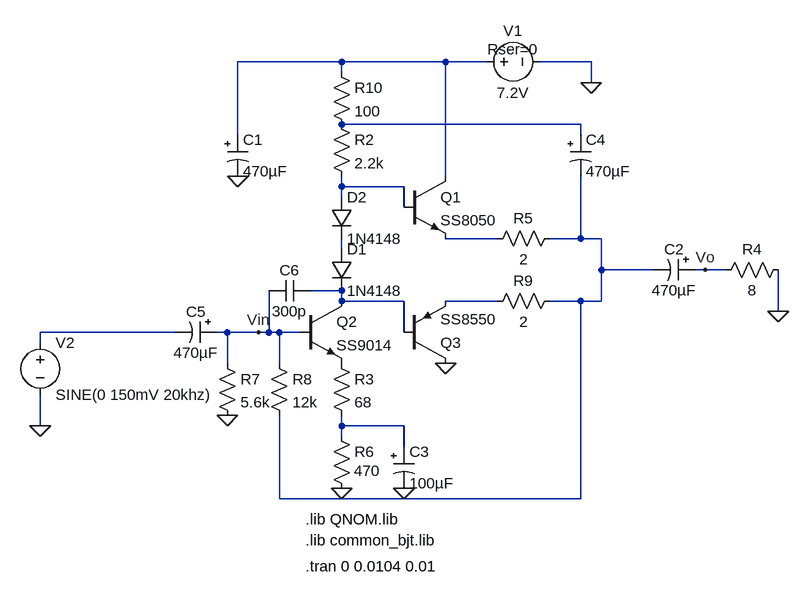
[diagram p0: schematic universal-audio-amplifer.asc]
universal-audio-amplifer.asc, the LTspice schematic file:
Version 4
SHEET 1 880 680
WIRE 64 -320 -96 -320
WIRE 224 -320 64 -320
WIRE 288 -320 224 -320
WIRE 448 -320 368 -320
WIRE 64 -304 64 -320
WIRE 448 -288 448 -320
WIRE 432 -224 64 -224
WIRE -96 -208 -96 -320
WIRE 432 -208 432 -224
WIRE 224 -144 224 -320
WIRE 64 -128 64 -144
WIRE 160 -128 64 -128
WIRE 64 -112 64 -128
WIRE 160 -96 160 -128
WIRE 304 -48 224 -48
WIRE 432 -48 432 -144
WIRE 432 -48 384 -48
WIRE 464 -48 432 -48
WIRE 64 -32 64 -48
WIRE 464 0 464 -48
WIRE 544 0 464 0
WIRE 624 0 608 0
WIRE 656 0 624 0
WIRE 64 32 16 32
WIRE 64 48 64 32
WIRE 160 48 64 48
WIRE 304 48 224 48
WIRE 432 48 384 48
WIRE 464 48 464 0
WIRE 464 48 432 48
WIRE 736 64 736 0
WIRE -192 96 -400 96
WIRE -112 96 -128 96
WIRE -64 96 -112 96
WIRE -48 96 -48 32
WIRE -48 96 -64 96
WIRE -32 96 -48 96
WIRE 0 96 -32 96
WIRE 160 96 160 48
WIRE -400 112 -400 96
WIRE -112 144 -112 96
WIRE -32 144 -32 96
WIRE -400 240 -400 192
WIRE 64 240 64 224
WIRE 160 240 64 240
WIRE 64 256 64 240
WIRE 160 272 160 240
WIRE -32 352 -32 224
WIRE 432 352 432 48
WIRE 432 352 -32 352
FLAG -400 240 0
FLAG 736 64 0
FLAG 160 336 0
FLAG 224 144 0
FLAG 64 336 0
FLAG -96 -144 0
FLAG 448 -288 0
FLAG -112 224 0
FLAG -64 96 Vin
FLAG 624 0 Vo
SYMBOL npn 160 -144 R0
SYMATTR InstName Q1
SYMATTR Value SS8050
SYMBOL voltage 272 -320 R270
WINDOW 0 32 56 VTop 2
WINDOW 3 -32 56 VBottom 2
WINDOW 123 0 0 Left 2
WINDOW 39 4 56 VTop 2
SYMATTR InstName V1
SYMATTR Value 7.2V
SYMATTR SpiceLine Rser=0
SYMBOL voltage -400 96 R0
WINDOW 123 0 0 Left 2
WINDOW 39 0 0 Left 2
SYMATTR InstName V2
SYMATTR Value SINE(0 150mV 20khz)
SYMBOL res 640 16 R270
WINDOW 0 32 56 VTop 2
WINDOW 3 0 56 VBottom 2
SYMATTR InstName R4
SYMATTR Value 8
SYMATTR SpiceLine tol=1% pwr=1
SYMBOL res 48 -240 R0
SYMATTR InstName R2
SYMATTR Value 2.2k
SYMATTR SpiceLine tol=1% pwr=1
SYMBOL npn 0 48 R0
SYMATTR InstName Q2
SYMATTR Value SS9014
SYMBOL pnp 160 144 M180
SYMATTR InstName Q3
SYMATTR Value SS8550
SYMBOL diode 48 -32 R0
SYMATTR InstName D1
SYMATTR Value 1N4148
SYMBOL diode 48 -112 R0
SYMATTR InstName D2
SYMATTR Value 1N4148
SYMBOL res 48 128 R0
SYMATTR InstName R3
SYMATTR Value 68
SYMATTR SpiceLine tol=1% pwr=1
SYMBOL res 48 240 R0
WINDOW 3 35 69 Left 2
SYMATTR InstName R6
SYMATTR Value 470
SYMATTR SpiceLine tol=1% pwr=1
SYMBOL res -128 128 R0
SYMATTR InstName R7
SYMATTR Value 5.6k
SYMATTR SpiceLine tol=1% pwr=1
SYMBOL res -48 128 R0
SYMATTR InstName R8
SYMATTR Value 12k
SYMATTR SpiceLine tol=1% pwr=1
SYMBOL polcap 144 272 R0
SYMATTR InstName C3
SYMATTR Value 100µF
SYMATTR SpiceLine V=50 Irms=22m Rser=3.9 Lser=0
SYMBOL polcap 416 -208 R0
SYMATTR InstName C4
SYMATTR Value 470µF
SYMATTR SpiceLine V=35 Irms=1.2 Rser=0.08 Lser=0
SYMBOL polcap -128 80 R90
WINDOW 0 0 32 VBottom 2
WINDOW 3 32 32 VTop 2
SYMATTR InstName C5
SYMATTR Value 470µF
SYMATTR SpiceLine V=100 Irms=10m Rser=0.01 Lser=0
SYMBOL polcap -112 -208 R0
SYMATTR InstName C1
SYMATTR Value 470µF
SYMATTR SpiceLine V=35 Irms=750m Rser=0.0016 Lser=0
SYMBOL res 288 -32 R270
WINDOW 0 32 56 VTop 2
WINDOW 3 0 56 VBottom 2
SYMATTR InstName R5
SYMATTR Value 2
SYMATTR SpiceLine tol=1% pwr=1
SYMBOL res 288 64 R270
WINDOW 0 32 56 VTop 2
WINDOW 3 0 56 VBottom 2
SYMATTR InstName R9
SYMATTR Value 2
SYMATTR SpiceLine tol=1% pwr=1
SYMBOL res 48 -320 R0
SYMATTR InstName R10
SYMATTR Value 100
SYMATTR SpiceLine tol=1% pwr=1
SYMBOL polcap 608 -16 R90
WINDOW 0 0 32 VBottom 2
WINDOW 3 32 32 VTop 2
SYMATTR InstName C2
SYMATTR Value 470µF
SYMATTR SpiceLine V=100 Irms=10m Rser=0.01 Lser=0
SYMBOL cap 16 16 R90
WINDOW 0 0 32 VBottom 2
WINDOW 3 32 32 VTop 2
SYMATTR InstName C6
SYMATTR Value 300p
SYMATTR SpiceLine V=10 Irms=0 Rser=0.009 Lser=0
TEXT 8 416 Left 2 !.lib common_bjt.lib
TEXT 8 456 Left 2 !.tran 0 0.0104 0.01
TEXT 8 384 Left 2 !.lib QNOM.lib

The netlist it stands for:
* universal-audio-amplifer.asc
Q1 N001 N003 N004 0 SS8050
V1 N001 0 7.2V Rser=0
V2 N009 0 SINE(0 150mV 20khz)
R4 Vo 0 8 tol=1% pwr=1
R2 N002 N003 2.2k tol=1% pwr=1
Q2 N007 Vin P001 0 SS9014
Q3 0 N007 N008 0 SS8550
D1 N006 N007 1N4148
D2 N003 N006 1N4148
R3 P001 N010 68 tol=1% pwr=1
R6 N010 0 470 tol=1% pwr=1
R7 Vin 0 5.6k tol=1% pwr=1
R8 Vin N005 12k tol=1% pwr=1
C3 N010 0 100µF V=50 Irms=22m Rser=3.9 Lser=0
C4 N002 N005 470µF V=35 Irms=1.2 Rser=0.08 Lser=0
C5 Vin N009 470µF V=100 Irms=10m Rser=0.01 Lser=0
C1 N001 0 470µF V=35 Irms=750m Rser=0.0016 Lser=0
R5 N004 N005 2 tol=1% pwr=1
R9 N008 N005 2 tol=1% pwr=1
R10 N001 N002 100 tol=1% pwr=1
C2 Vo N005 470µF V=100 Irms=10m Rser=0.01 Lser=0
C6 N007 Vin 300p V=10 Irms=0 Rser=0.009 Lser=0
.model D D
.lib standard.dio
.model NPN NPN
.model PNP PNP
.lib standard.bjt
.lib common_bjt.lib
.tran 0 0.0104 0.01
.lib QNOM.lib
.backanno
.end